# Altium schematic sheet MCU.SchDoc: MCU
size 420 x 297 mm; SheetNumber: 12; SheetTotal: 12
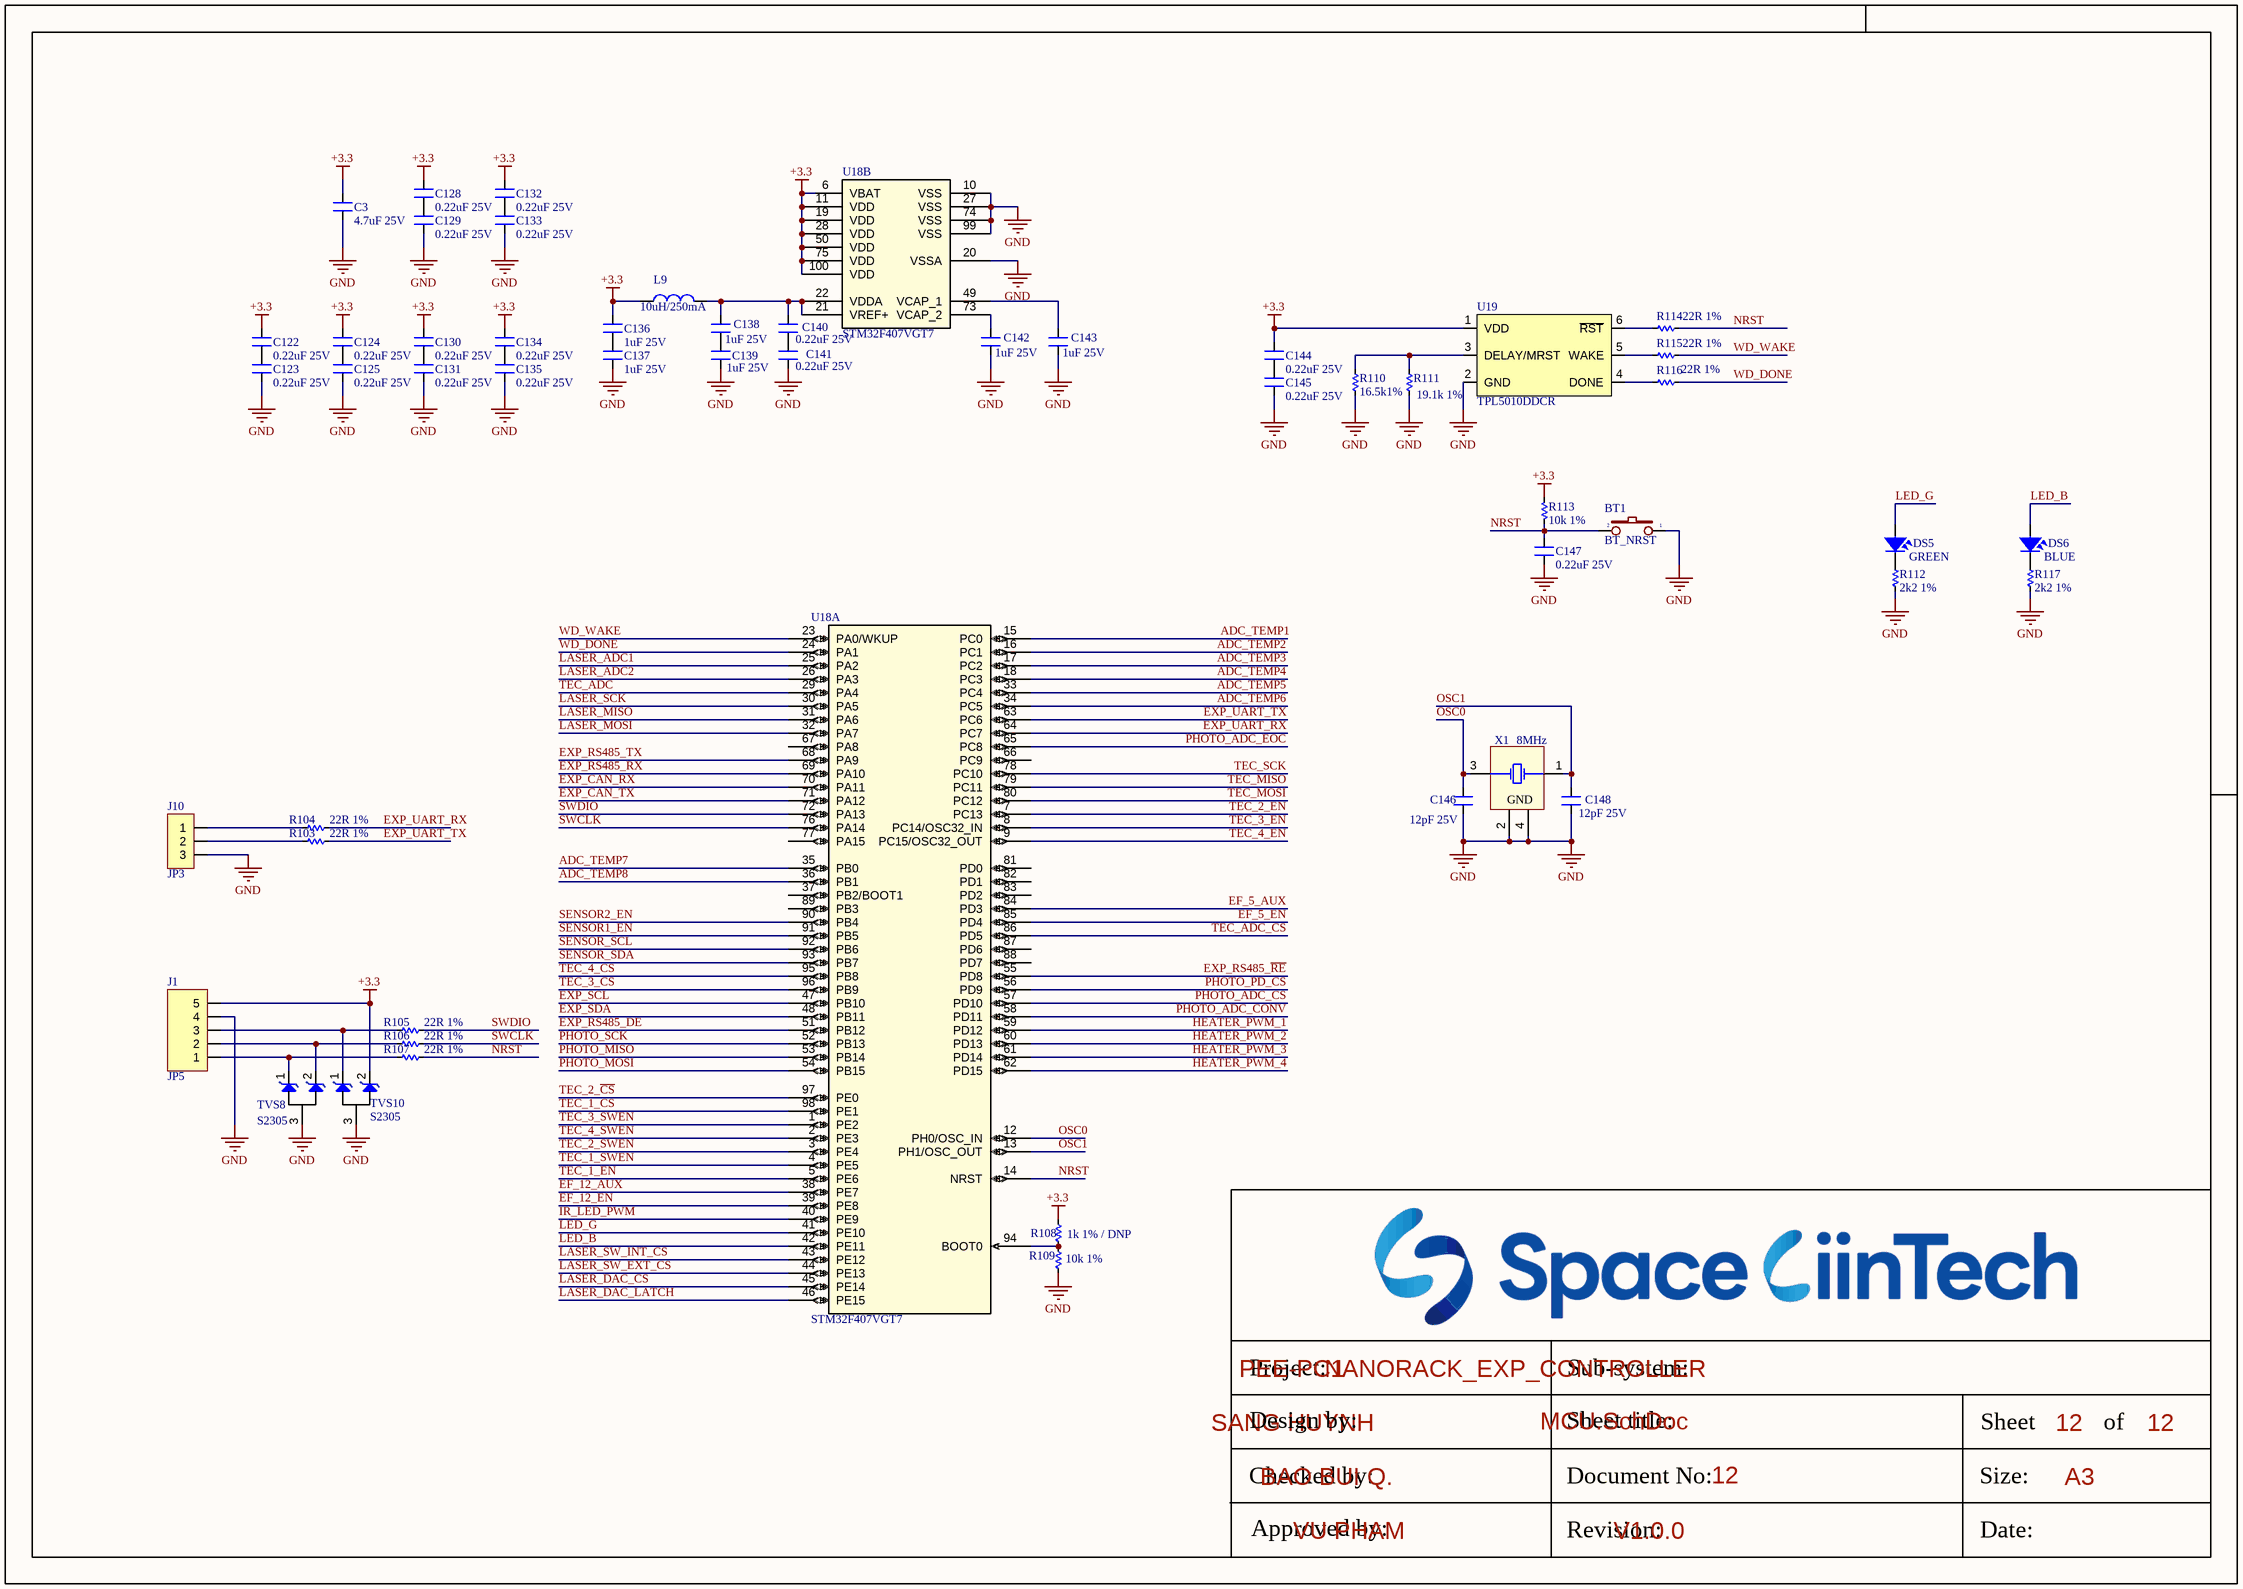
[diagram p0: MCU.SchDoc]

## Parts
BT1  BT_NRST  [SW1-SMD]
C3  4.7uF 25V  [CN-SMD-0603-EXP-V101]
C122  0.22uF 25V  [CN-SMD-0603-EXP-V101]
C123  0.22uF 25V  [CN-SMD-0603-EXP-V101]
C124  0.22uF 25V  [CN-SMD-0603-EXP-V101]
C125  0.22uF 25V  [CN-SMD-0603-EXP-V101]
C128  0.22uF 25V  [CN-SMD-0603-EXP-V101]
C129  0.22uF 25V  [CN-SMD-0603-EXP-V101]
C130  0.22uF 25V  [CN-SMD-0603-EXP-V101]
C131  0.22uF 25V  [CN-SMD-0603-EXP-V101]
C132  0.22uF 25V  [CN-SMD-0603-EXP-V101]
C133  0.22uF 25V  [CN-SMD-0603-EXP-V101]
C134  0.22uF 25V  [CN-SMD-0603-EXP-V101]
C135  0.22uF 25V  [CN-SMD-0603-EXP-V101]
C136  1uF 25V  [CN-SMD-0603-EXP-V101]
C137  1uF 25V  [CN-SMD-0603-EXP-V101]
C138  1uF 25V  [CN-SMD-0603-EXP-V101]
C139  1uF 25V  [CN-SMD-0603-EXP-V101]
C140  0.22uF 25V  [CN-SMD-0603-EXP-V101]
C141  0.22uF 25V  [CN-SMD-0603-EXP-V101]
C142  1uF 25V  [CN-SMD-0603-EXP-V101]
C143  1uF 25V  [CN-SMD-0603-EXP-V101]
C144  0.22uF 25V  [CN-SMD-0603-EXP-V101]
C145  0.22uF 25V  [CN-SMD-0603-EXP-V101]
C146  12pF 25V  [CN-SMD-0603-EXP-V101]
C147  0.22uF 25V  [CN-SMD-0603-EXP-V101]
C148  12pF 25V  [CN-SMD-0603-EXP-V101]
DS5  GREEN  [LED-0603-BLUE-EXP-V01]
DS6  BLUE  [LED-0603-BLUE-EXP-V01]
J1  JP5  [JP5-D1C]
J10  JP3  [JP3-D1C]
L9  10uH/250mA  [L-SMD-0603-EXP-V101]
R103  22R 1%  [RES-SMD-0603-EXP-V101]
R104  22R 1%  [RES-SMD-0603-EXP-V101]
R105  22R 1%  [RES-SMD-0603-EXP-V101]
R106  22R 1%  [RES-SMD-0603-EXP-V101]
R107  22R 1%  [RES-SMD-0603-EXP-V101]
R108  1k 1% / DNP  [RES-SMD-0603-EXP-V101]
R109  10k 1%  [RES-SMD-0603-EXP-V101]
R110  16.5k1%  [RES-SMD-0603-EXP-V101]
R111  19.1k 1%  [RES-SMD-0603-EXP-V101]
R112  2k2 1%  [RES-SMD-0603-EXP-V101]
R113  10k 1%  [RES-SMD-0603-EXP-V101]
R114  22R 1%  [RES-SMD-0603-EXP-V101]
R115  22R 1%  [RES-SMD-0603-EXP-V101]
R116  22R 1%  [RES-SMD-0603-EXP-V101]
R117  2k2 1%  [RES-SMD-0603-EXP-V101]
TVS8  S2305  [sot23-12_3]
TVS10  S2305  [sot23-12_3]
U18  STM32F407VGT7  [LQFP-100-EXP-v101]  (parts A,B of 2)
U19  TPL5010DDCR  [SOT23-6-123_456]
X1  8MHz  [XT4-16.000MHz-4_V]

## Nets
+3.3: C3.2 C122.2 C124.2 C128.2 C130.2 C132.2 C134.2 C136.2 C144.2 J1.5 L9.1 R108.1 R113.1 TVS10.2 U18.6(VBAT) U18.11(VDD) U18.19(VDD) U18.28(VDD) U18.50(VDD) U18.75(VDD) U18.100(VDD) U19.1(VDD)
GND: BT1.1 C3.1 C123.1 C125.1 C129.1 C131.1 C133.1 C135.1 C137.1 C139.1 C141.1 C142.1 C143.1 C145.1 C146.2 C147.1 C148.1 J1.4 J10.3 R109.2 R110.1 R111.1 R112.2 R117.2 TVS8.3 TVS10.3 U18.10(VSS) U18.20(VSSA) U18.27(VSS) U18.74(VSS) U18.99(VSS) U19.2(GND) X1.2(GND) X1.4(GND)
ADC_TEMP1: U18.15(PC0)
ADC_TEMP2: U18.16(PC1)
ADC_TEMP3: U18.17(PC2)
ADC_TEMP4: U18.18(PC3)
ADC_TEMP5: U18.33(PC4)
ADC_TEMP6: U18.34(PC5)
ADC_TEMP7: U18.35(PB0)
ADC_TEMP8: U18.36(PB1)
EF_5_AUX: U18.84(PD3)
EF_5_EN: U18.85(PD4)
EF_12_AUX: U18.38(PE7)
EF_12_EN: U18.39(PE8)
EXP_CAN_RX: U18.70(PA11)
EXP_CAN_TX: U18.71(PA12)
EXP_RS485_DE: U18.51(PB12)
EXP_RS485_~{RE}: U18.55(PD8)
EXP_RS485_RX: U18.69(PA10)
EXP_RS485_TX: U18.68(PA9)
EXP_SCL: U18.47(PB10)
EXP_SDA: U18.48(PB11)
EXP_UART_RX: R104.1 U18.64(PC7)
EXP_UART_TX: R103.1 U18.63(PC6)
HEATER_PWM_1: U18.59(PD12)
HEATER_PWM_2: U18.60(PD13)
HEATER_PWM_3: U18.61(PD14)
HEATER_PWM_4: U18.62(PD15)
IR_LED_PWM: U18.40(PE9)
LASER_ADC1: U18.25(PA2)
LASER_ADC2: U18.26(PA3)
LASER_DAC_CS: U18.45(PE14)
LASER_DAC_LATCH: U18.46(PE15)
LASER_MISO: U18.31(PA6)
LASER_MOSI: U18.32(PA7)
LASER_SCK: U18.30(PA5)
LASER_SW_EXT_CS: U18.44(PE13)
LASER_SW_INT_CS: U18.43(PE12)
LED_B: DS6.1 U18.42(PE11)
LED_G: DS5.1 U18.41(PE10)
NRST: BT1.2 C147.2 R107.1 R113.2 R114.2 U18.14(NRST)
OSC0: C146.1 U18.12(PH0/OSC_IN) X1.3(XTAL)
OSC1: C148.2 U18.13(PH1/OSC_OUT) X1.1(XTAL)
PHOTO_ADC_CONV: U18.58(PD11)
PHOTO_ADC_CS: U18.57(PD10)
PHOTO_ADC_EOC: U18.65(PC8)
PHOTO_MISO: U18.53(PB14)
PHOTO_MOSI: U18.54(PB15)
PHOTO_PD_CS: U18.56(PD9)
PHOTO_SCK: U18.52(PB13)
SENSOR1_EN: U18.91(PB5)
SENSOR2_EN: U18.90(PB4)
SENSOR_SCL: U18.92(PB6)
SENSOR_SDA: U18.93(PB7)
SWCLK: R106.1 U18.76(PA14)
SWDIO: R105.1 U18.72(PA13)
TEC_1_~{CS}: U18.98(PE1)
TEC_1_EN: U18.5(PE6)
TEC_1_SWEN: U18.4(PE5)
TEC_2_~{CS}: U18.97(PE0)
TEC_2_EN: U18.7(PC13)
TEC_2_SWEN: U18.3(PE4)
TEC_3_~{CS}: U18.96(PB9)
TEC_3_EN: U18.8(PC14/OSC32_IN)
TEC_3_SWEN: U18.1(PE2)
TEC_4_~{CS}: U18.95(PB8)
TEC_4_EN: U18.9(PC15/OSC32_OUT)
TEC_4_SWEN: U18.2(PE3)
TEC_ADC: U18.29(PA4)
TEC_ADC_~{CS}: U18.86(PD5)
TEC_MISO: U18.79(PC11)
TEC_MOSI: U18.80(PC12)
TEC_SCK: U18.78(PC10)
WD_DONE: R116.2 U18.24(PA1)
WD_WAKE: R115.2 U18.23(PA0/WKUP)
NetC122_1: C122.1 C123.2
NetC124_1: C124.1 C125.2
NetC128_1: C128.1 C129.2
NetC130_1: C130.1 C131.2
NetC132_1: C132.1 C133.2
NetC134_1: C134.1 C135.2
NetC136_1: C136.1 C137.2
NetC138_1: C138.1 C139.2
NetC138_2: C138.2 C140.2 L9.2 U18.21(VREF+) U18.22(VDDA)
NetC140_1: C140.1 C141.2
NetC142_2: C142.2 U18.73(VCAP_2)
NetC143_2: C143.2 U18.49(VCAP_1)
NetC144_1: C144.1 C145.2
NetDS5_2: DS5.2 R112.1
NetDS6_2: DS6.2 R117.1
NetJ1_1: J1.1 R107.2 TVS8.1
NetJ1_2: J1.2 R106.2 TVS8.2
NetJ1_3: J1.3 R105.2 TVS10.1
NetJ10_1: J10.1 R104.2
NetJ10_2: J10.2 R103.2
NetR108_2: R108.2 R109.1 U18.94(BOOT0)
NetR110_2: R110.2 R111.2 U19.3(DELAY/MRST)
NetR114_1: R114.1 U19.6(~{RST})
NetR115_1: R115.1 U19.5(WAKE)
NetR116_1: R116.1 U19.4(DONE)

Not connected (* = marked no-connect by the designer): U18 37(PB2/BOOT1) 66(PC9) 67(PA8) 77(PA15) 81(PD0) 82(PD1) 83(PD2) 87(PD6) 88(PD7) 89(PB3)

## Notes on the sheet
- Project:
- PEE-PC1
- Sub-system:
- NANORACK_EXP_CONTROLLER
- Design by:
- SANG HUYNH
- BAO BUI Q.
- Sheet title:
- Sheet
- A3
- of
- Checked by:
- Approved by:
- VU PHAM
- Revision:
- Document No:
- V1.0.0
- Size:
- Date:

## Library data of the parts
BT1 = SW2: Switch button 2 pin; Value: SW chip 2 pin
C3 C122-C125 C128-C148 = Capacitors: Value: 33pF
DS5 DS6 = LED SMD: Value: LED 3 - 5 ly 2 Colour
J1 = JP5: WR-PHD 2.54 mm Angled Socket Header; Manufacturer: W¨¹rth Elektronik eiSos GmbH; partNo: 613005143121; ComponentLink1 Description: Manufacturer; ComponentLink2 Description: Datasheet; NoPins: 05; Created Date: 29 March 2013; ComponentLink1URL: http://www.we-online.com; ComponentLink2URL: http://katalog.we-online.de/em/datasheet/6130xx143121.pdf; Created by: Karrer Zheng
J10 = JP3: WR-PHD 2.54 mm Angled Socket Header; Manufacturer: W¨¹rth Elektronik eiSos GmbH; partNo: 613003143121; ComponentLink1 Description: Manufacturer; ComponentLink2 Description: Datasheet; NoPins: 03; Created Date: 29 March 2013; ComponentLink1URL: http://www.we-online.com; ComponentLink2URL: http://katalog.we-online.de/em/datasheet/6130xx143121.pdf; Created by: Karrer Zheng
L9 = L-SMD-1: partNo: 78477010; Manufacturer: Wurth Elektronik; Inductance: 1.0 μH; ComponentLink1Description: Manufacturer; ComponentLink1URL: http://www.we-online.de; Created by: Baojun Chen; Created Date: Nov.2015; ComponentLink2Description: Datasheet; ComponentLink2URL: http://katalog.we-online.de/pbs/datasheet/78477010.pdf
R103-R117 = Res SMD: SMD; Manufacturer: Generic Components; Class: Passive; Published: 08/06/2000; Publisher: Altium Hobart Technology Centre
TVS8 TVS10 = S2305: TVS DIODE 5VWM 10.8VC SOT23
U18 = STM32F407VGT7: ARM® Cortex®-M4 STM32F4 Microcontroller IC 32-Bit Single-Core 168MHz 1MB (1M x 8) FLASH 100-LQFP (14x14)
U19 = TPL5010DDCR: IC OSC PROG TIMER TSOT23-6
X1 = XT4: Crystal, 8 MHz, -30 to 85 degC, 3.2 x 2.5 x 0.9 mm SMD; Value: 4Mhz